# EAGLE design gShield myRio_V1 (EAGLE 7.1.0)
CNAME: PXL-TECH; CREVISION: 1.0; DESIGNER: Glenn Kerselaers
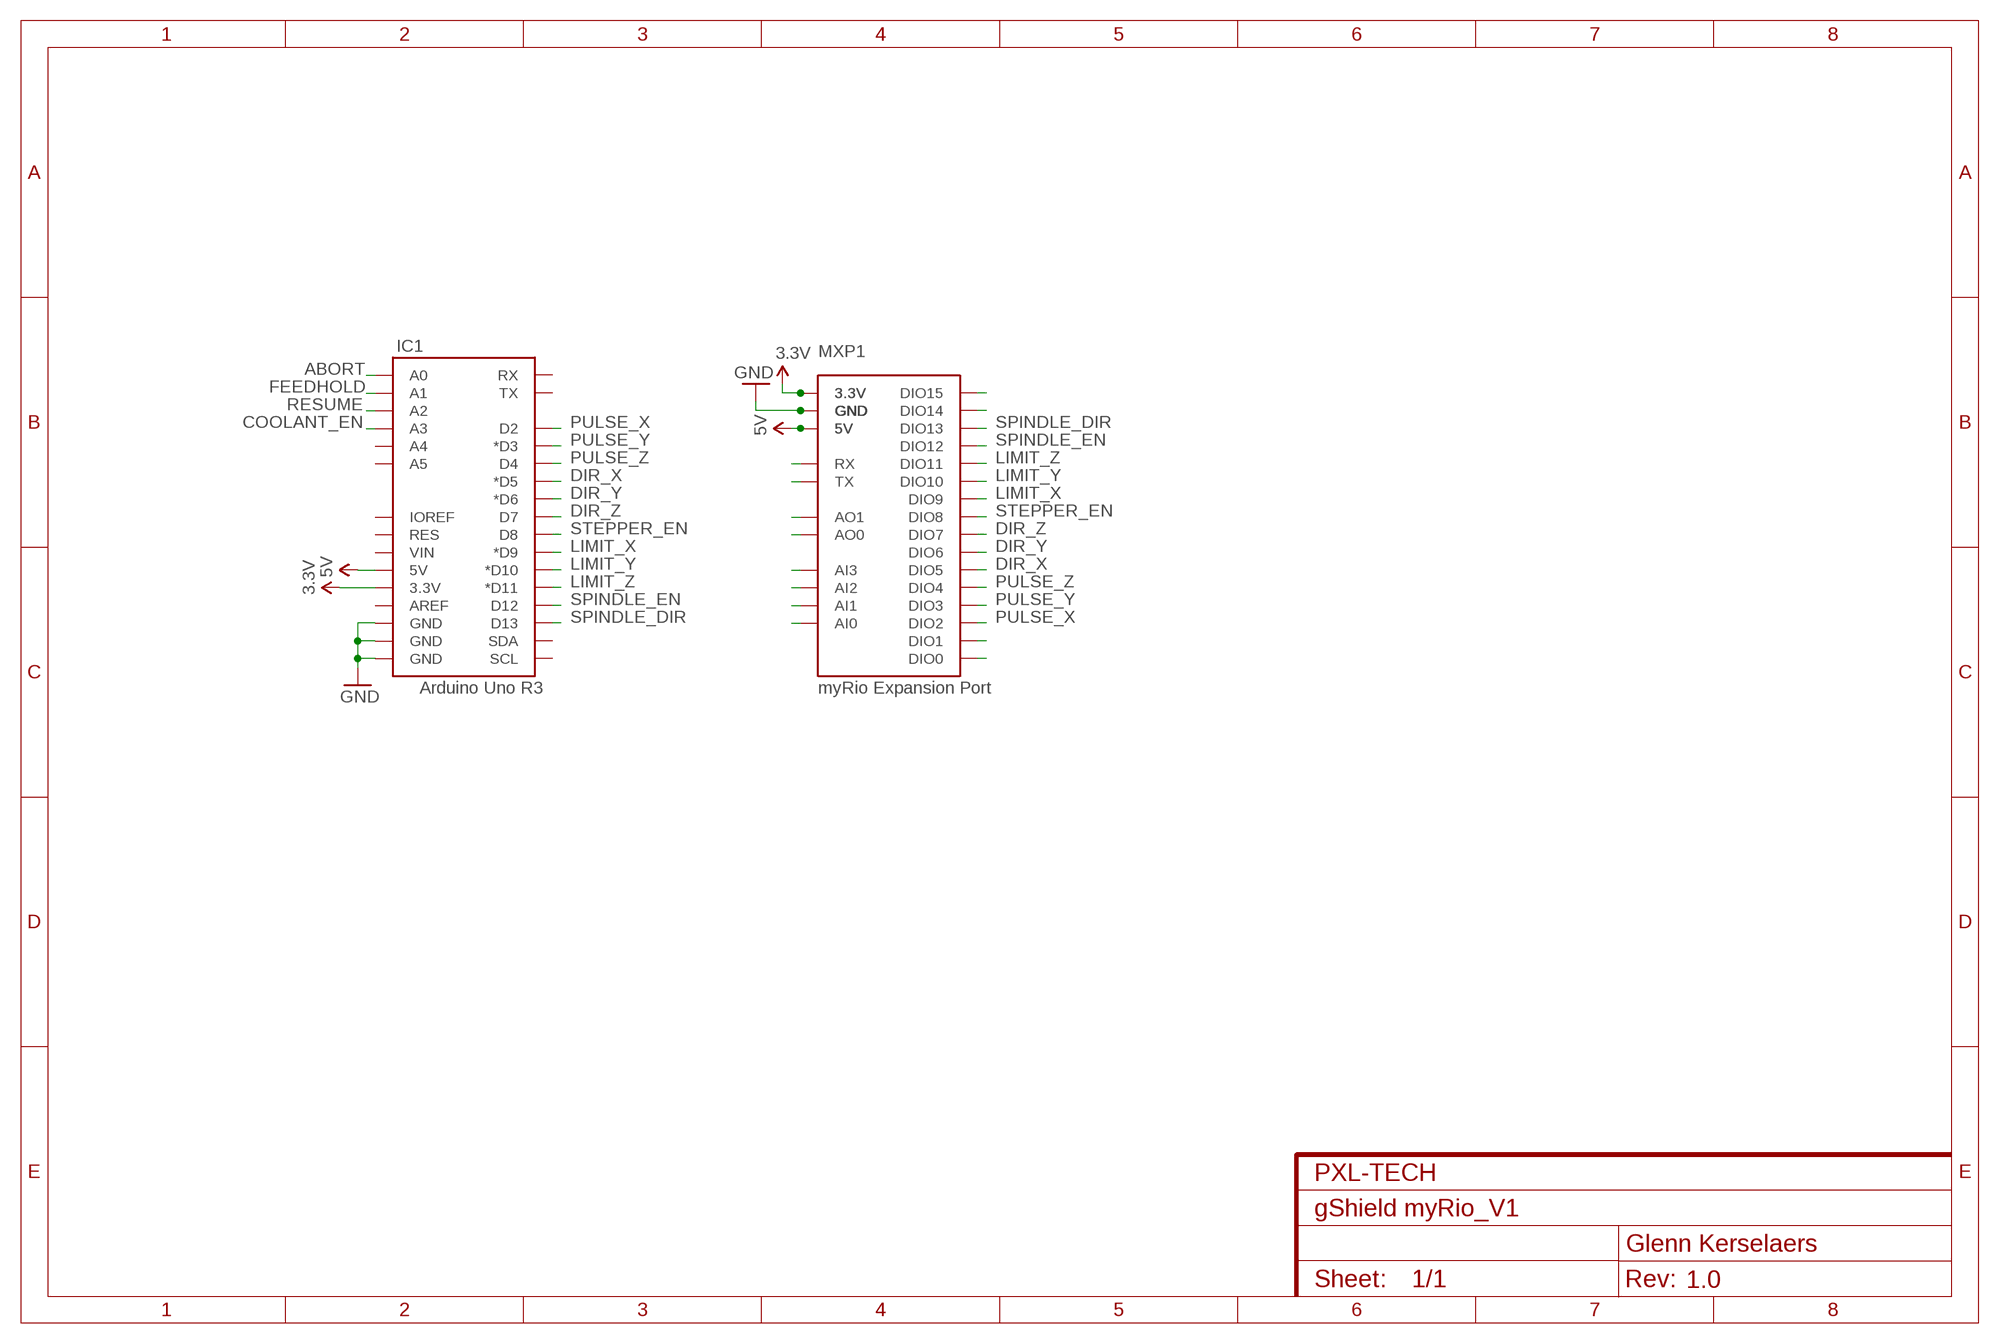
[diagram p0: schematic, sheet 1]

## Parts
IC1  Arduino Uno R3  ARDUINO_R3_SHIELDNOLABELS  [UNO_R3_SHIELD_NOLABELS]
MXP1  myRio Expansion Port  MYRIO-EXPENSION_PORT  [MYRIO-EXPENSION_PORT]

## Nets
3.3V: IC1.3.3V MXP1.3.3V@1(3.3V) MXP1.3.3V@2(3.3V)
5V: IC1.5V MXP1.5V@1(5V) MXP1.5V@2(5V)
ABORT: IC1.A0
COOLANT_EN: IC1.A3
DIR_X: IC1.D5(*D5) MXP1.DIO5
DIR_Y: IC1.D6(*D6) MXP1.DIO6
DIR_Z: IC1.D7 MXP1.DIO7
FEEDHOLD: IC1.A1
GND: IC1.GND@0(GND) IC1.GND@1(GND) IC1.GND@2(GND) MXP1.GND@1(GND) MXP1.GND@2(GND) MXP1.GND@3(GND) MXP1.GND@4(GND) MXP1.GND@5(GND) MXP1.GND@6(GND) MXP1.GND@7(GND)
LIMIT_X: IC1.D9(*D9) MXP1.DIO9
LIMIT_Y: IC1.D10(*D10) MXP1.DIO10
LIMIT_Z: IC1.D11(*D11) MXP1.DIO11
N$1: MXP1.RX
N$2: MXP1.TX
N$3: MXP1.AO1
N$4: MXP1.AO0
N$5: MXP1.AI3
N$6: MXP1.AI2
N$7: MXP1.AI1
N$8: MXP1.AI0
N$9: MXP1.DIO0
N$10: MXP1.DIO1
N$23: MXP1.DIO14
N$24: MXP1.DIO15
PULSE_X: IC1.D2 MXP1.DIO2
PULSE_Y: IC1.D3(*D3) MXP1.DIO3
PULSE_Z: IC1.D4 MXP1.DIO4
RESUME: IC1.A2
SPINDLE_DIR: IC1.D13 MXP1.DIO13
SPINDLE_EN: IC1.D12 MXP1.DIO12
STEPPER_EN: IC1.D8 MXP1.DIO8
Unconnected: IC1.A4 IC1.A5 IC1.AREF IC1.IOREF IC1.RES IC1.RX IC1.SCL IC1.SDA IC1.TX IC1.VIN

## Library data of the parts
IC1 = SparkFun-Boards:ARDUINO_R3_SHIELD: Shield form compatible with the Arduino Uno R3.
MXP1 = MyLibrary:MYRIO-EXPENSION_PORT

## Board
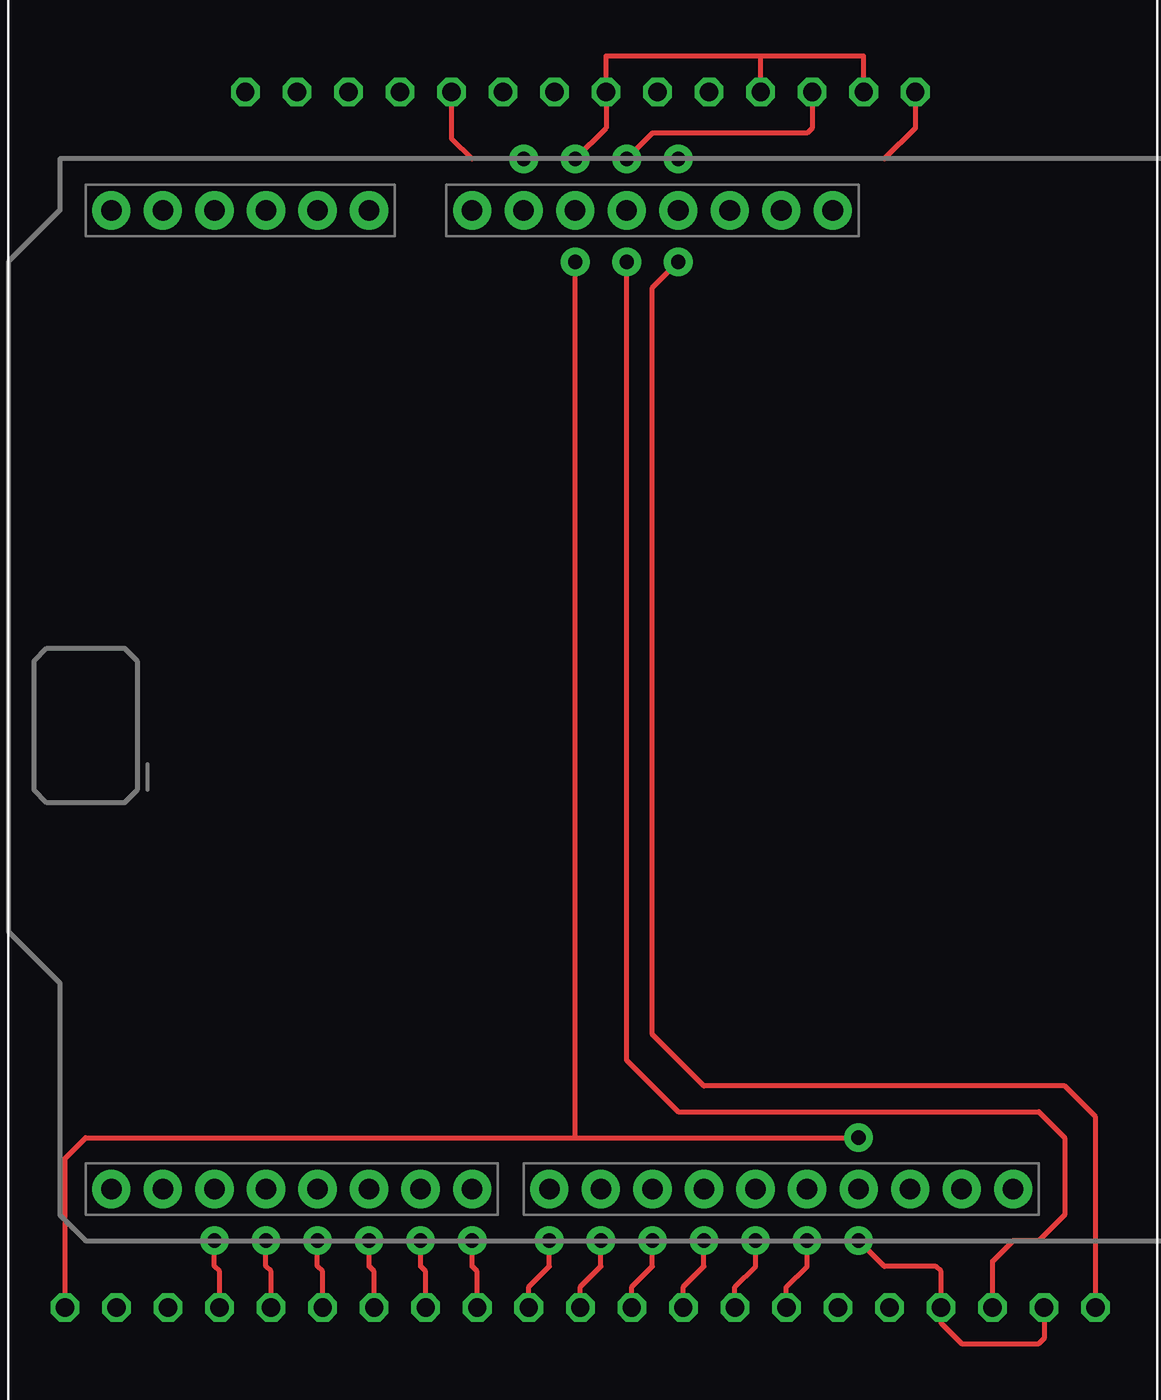
[diagram p1: board, top side]
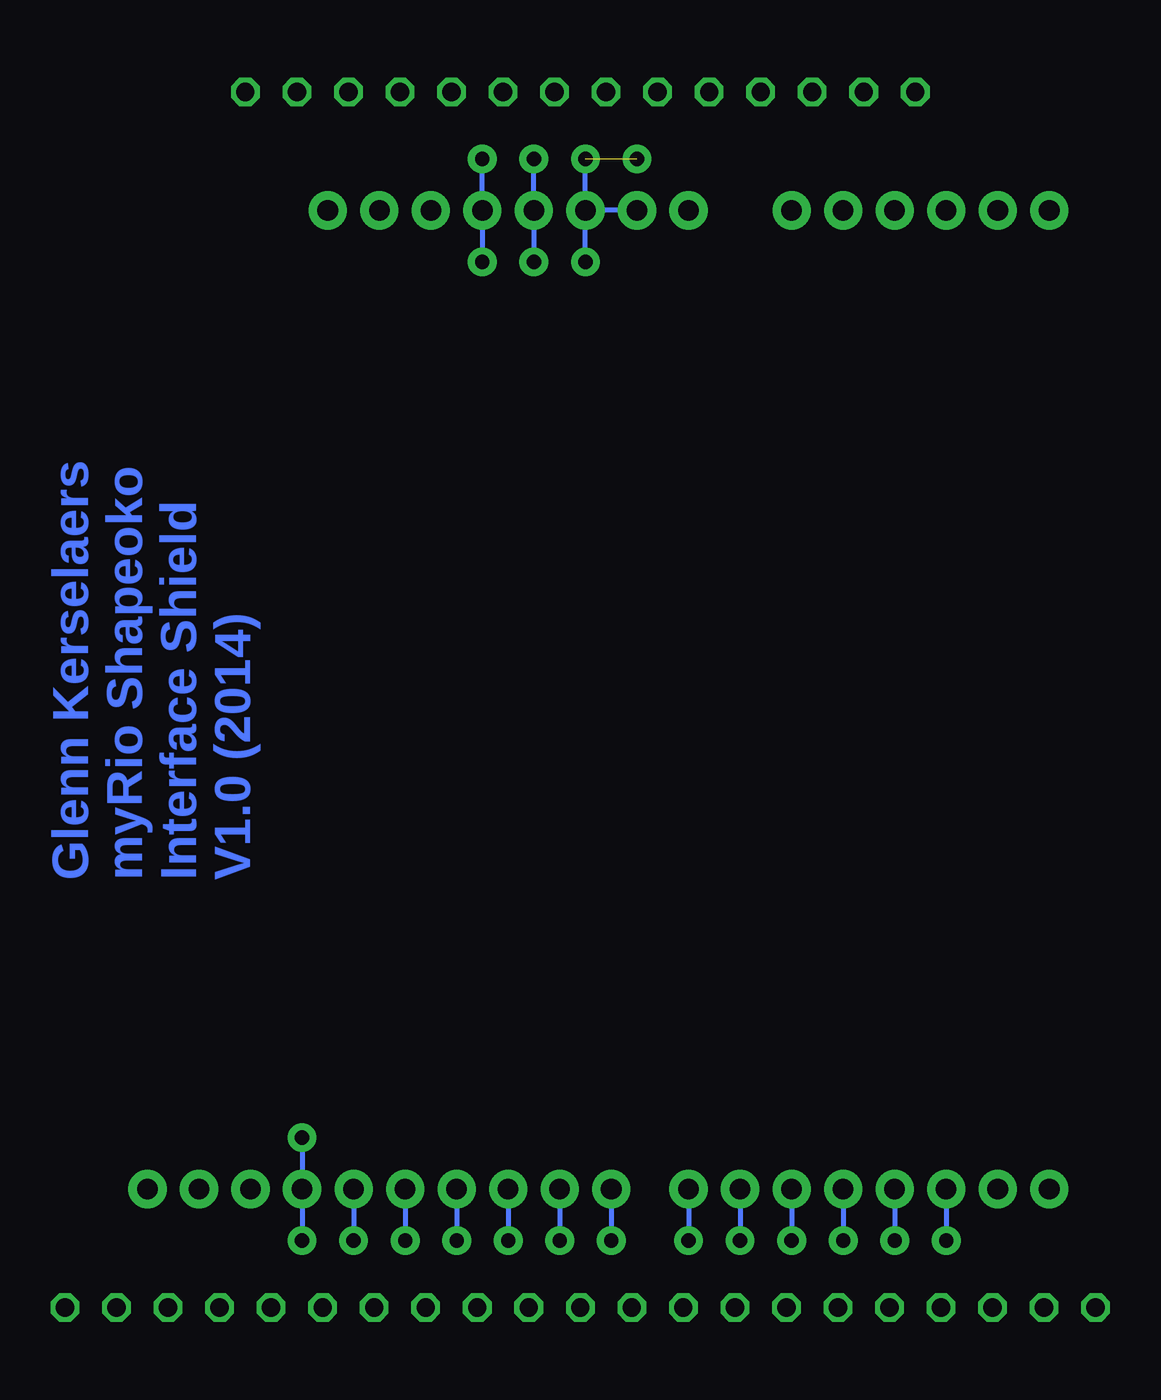
[diagram p2: board, bottom side, seen from below]

No outline drawn. Coordinates in mm, seen from the top.
Copper layers (1*16): Top 0.035mm / dielectric 1.5mm / Bottom 0.035mm
Design rules "default": minimum track width 10mil, minimum drill 24mil, track to track 8mil, track to pad 8mil, pad to pad 8mil, via to via 8mil, smd to smd 8mil, copper to edge 40mil, drill to drill 8mil, minimum pad ring 10mil, minimum via ring 8mil, stop-mask expansion 4mil, vias tented up to drill 0mil, thermal gap 10mil

### Footprints (pad centres in the part's own frame; a part is rotated, then mirrored left to right if it is on the bottom)
UNO_R3_SHIELD_NOLABELS = drill 1.016 pad 1.88: 3.3V 50.8,26.67; 5V 50.8,29.21; A0 50.8,41.91; A1 50.8,44.45; A2 50.8,46.99; A3 50.8,49.53; A4 50.8,52.07; A5 50.8,54.61; AREF 2.54,15.24; D2 2.54,49.53; D3 2.54,46.99; D4 2.54,44.45; D5 2.54,41.91; D6 2.54,39.37; D7 2.54,36.83; D8 2.54,33.02; D9 2.54,30.48; D10 2.54,27.94; D11 2.54,25.4; D12 2.54,22.86; D13 2.54,20.32; GND@0 50.8,31.75; GND@1 50.8,34.29; GND@2 2.54,17.78; IOREF 50.8,21.59; NC 50.8,19.05; RES 50.8,24.13; RX 2.54,54.61; SCL 2.54,10.16; SDA 2.54,12.7; TX 2.54,52.07; VIN 50.8,36.83
MYRIO-EXPENSION_PORT = drill 0.9 octagon: 3.3V@1 53.594,11.938; 3.3V@2 44.704,71.882; 5V@1 48.514,11.938; 5V@2 39.624,71.882; AI0 11.684,71.882; AI1 14.224,71.882; AI2 16.764,71.882; AI3 19.304,71.882; AO0 24.384,71.882; AO1 26.924,71.882; DIO0 5.334,11.938; DIO1 7.874,11.938; DIO2 10.414,11.938; DIO3 12.954,11.938; DIO4 15.494,11.938; DIO5 18.034,11.938; DIO6 20.574,11.938; DIO7 23.114,11.938; DIO8 25.654,11.938; DIO9 28.194,11.938; DIO10 30.734,11.938; DIO11 33.274,11.938; DIO12 35.814,11.938; DIO13 38.354,11.938; DIO14 40.894,11.938; DIO15 43.434,11.938; GND@1 2.794,11.938; GND@2 45.974,11.938; GND@3 51.054,11.938; GND@4 21.844,71.882; GND@5 29.464,71.882; GND@6 37.084,71.882; GND@7 42.164,71.882; RX 34.544,71.882; TX 32.004,71.882

### Placement (x,y rotation side)
IC1  59.69,15.24 90 top
MXP1  0,0 0 top

### Tracks (layer width: path | path; a pad name or v marks a point on that pad's centre or on a via)
3.3V  (via drill 0.7 pad 1.42)
  Top 0.254: MXP1.3.3V@2 44.7,70.1 43.18,68.58 v33.02,68.58 | MXP1.3.3V@1 53.59,21.34 52.07,22.86 34.29,22.86 31.75,25.4 31.75,62.23 v33.02,63.5
  Bottom 0.254: v33.02,63.5 IC1.3.3V v33.02,68.58
5V  (via drill 0.7 pad 1.42)
  Top 0.254: MXP1.5V@2 39.62,70.1 39.37,69.85 31.75,69.85 v30.48,68.58 | MXP1.5V@1 48.51,14.22 49.53,15.24 50.8,15.24 52.07,16.51 52.07,20.32 50.8,21.59 33.02,21.59 30.48,24.13 v30.48,63.5
  Bottom 0.254: v30.48,63.5 IC1.5V v30.48,68.58
DIR_X  (via drill 0.7 pad 1.42)
  Top 0.254: MXP1.DIO5 18.03,13.72 17.78,13.97 v17.78,15.24
  Bottom 0.254: IC1.D5 v17.78,15.24
DIR_Y  (via drill 0.7 pad 1.42)
  Top 0.254: MXP1.DIO6 20.57,13.72 20.32,13.97 v20.32,15.24
  Bottom 0.254: IC1.D6 v20.32,15.24
DIR_Z  (via drill 0.7 pad 1.42)
  Top 0.254: MXP1.DIO7 23.11,13.72 22.86,13.97 v22.86,15.24
  Bottom 0.254: IC1.D7 v22.86,15.24
GND  (via drill 0.7, 0.7 pad 1.42)  (1 unrouted)
  Top 0.254: v25.4,68.58 22.86,68.58 21.84,69.6 MXP1.GND@4 | 37.08,73.66 29.46,73.66 MXP1.GND@5 29.46,70.1 v27.94,68.58 | 37.08,73.66 42.16,73.66 MXP1.GND@7 | MXP1.GND@6 37.08,73.66 | v41.91,15.24 43.18,13.97 45.72,13.97 45.97,13.72 MXP1.GND@2 45.97,11.18 46.99,10.16 50.8,10.16 51.05,10.41 MXP1.GND@3 | MXP1.GND@1 2.79,19.3 3.81,20.32 27.94,20.32 | 27.94,20.32 v41.91,20.32 | 27.94,20.32 v27.94,63.5
  Bottom 0.254: v27.94,63.5 IC1.GND@0 | IC1.GND@1 IC1.GND@0 | IC1.GND@0 v27.94,68.58 | v41.91,20.32 IC1.GND@2 v41.91,15.24
LIMIT_X  (via drill 0.7 pad 1.42)
  Top 0.254: MXP1.DIO9 28.19,12.95 29.21,13.97 v29.21,15.24
  Bottom 0.254: IC1.D9 v29.21,15.24
LIMIT_Y  (via drill 0.7 pad 1.42)
  Top 0.254: MXP1.DIO10 30.73,12.95 31.75,13.97 v31.75,15.24
  Bottom 0.254: IC1.D10 v31.75,15.24
LIMIT_Z  (via drill 0.7 pad 1.42)
  Top 0.254: MXP1.DIO11 33.27,12.95 34.29,13.97 v34.29,15.24
  Bottom 0.254: IC1.D11 v34.29,15.24
N$11  (via drill 0.51)
  other vias: 33.02,68.58
N$12  (via drill 0.7 pad 1.42)
  other vias: 33.02,63.5
N$13  (via drill 0.7 pad 1.42)
  other vias: 27.94,63.5
N$14  (via drill 0.7 pad 1.27)
  other vias: 30.48,63.5
PULSE_X  (via drill 0.7 pad 1.42)
  Top 0.254: MXP1.DIO2 10.41,13.72 10.16,13.97 v10.16,15.24
  Bottom 0.254: IC1.D2 v10.16,15.24
PULSE_Y  (via drill 0.7 pad 1.42)
  Top 0.254: MXP1.DIO3 12.95,13.72 12.7,13.97 v12.7,15.24
  Bottom 0.254: IC1.D3 v12.7,15.24
PULSE_Z  (via drill 0.7 pad 1.42)
  Top 0.254: MXP1.DIO4 15.49,13.72 15.24,13.97 v15.24,15.24
  Bottom 0.254: IC1.D4 v15.24,15.24
SPINDLE_DIR  (via drill 0.7 pad 1.42)
  Top 0.254: MXP1.DIO13 38.35,12.95 39.37,13.97 v39.37,15.24
  Bottom 0.254: IC1.D13 v39.37,15.24
SPINDLE_EN  (via drill 0.7 pad 1.42)
  Top 0.254: MXP1.DIO12 35.81,12.95 36.83,13.97 v36.83,15.24
  Bottom 0.254: IC1.D12 v36.83,15.24
STEPPER_EN  (via drill 0.7 pad 1.42)
  Top 0.254: MXP1.DIO8 25.65,12.95 26.67,13.97 v26.67,15.24
  Bottom 0.254: IC1.D8 v26.67,15.24

### Text on the board
Bottom: Glenn Kerselaers / myRio Shapeoko / Interface Shield / V1.0 (2014)